# Altium schematic sheet PG01_ Cover Sheet.SchDoc
size 420 x 297 mm
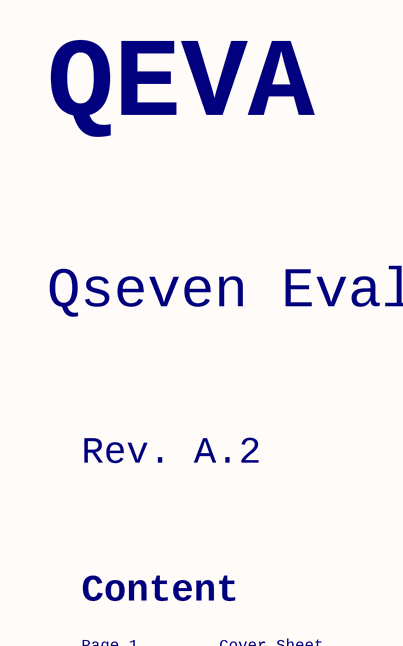
[diagram p0: PG01_ Cover Sheet.SchDoc, top left]
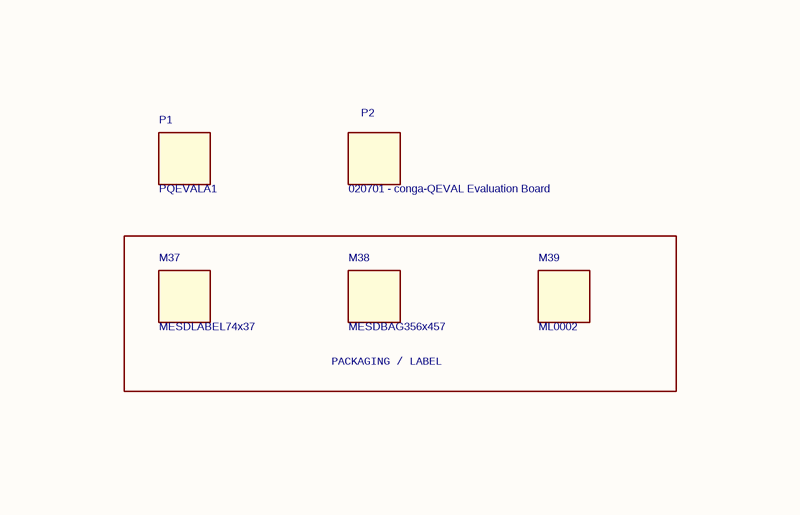
[diagram p1: PG01_ Cover Sheet.SchDoc, top right]
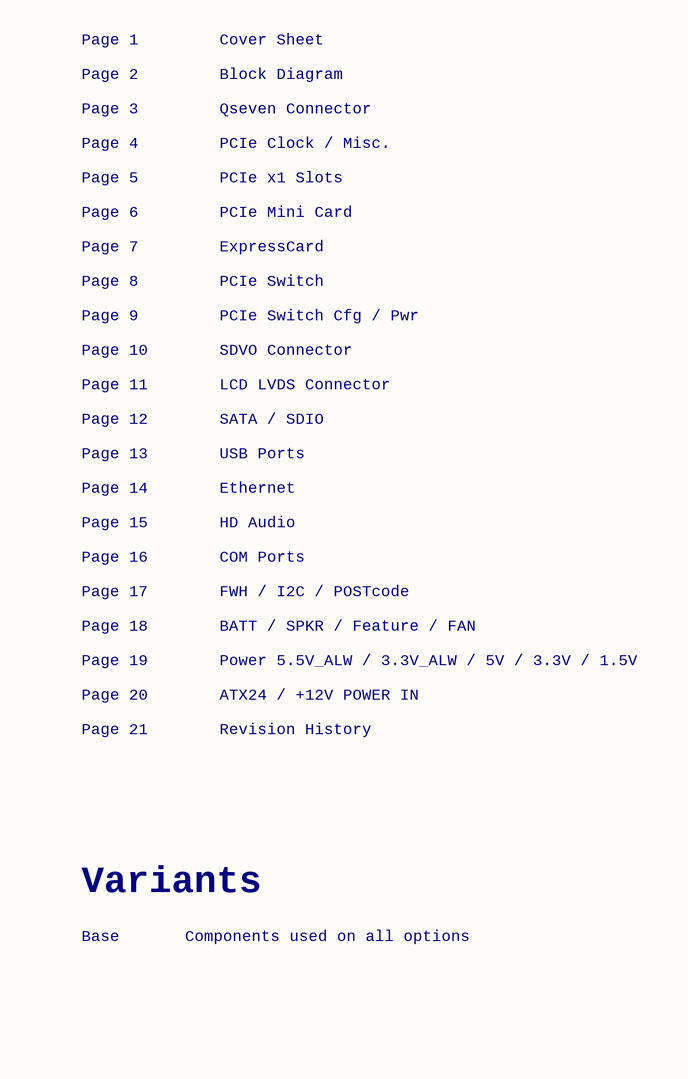
[diagram p2: PG01_ Cover Sheet.SchDoc, bottom left]
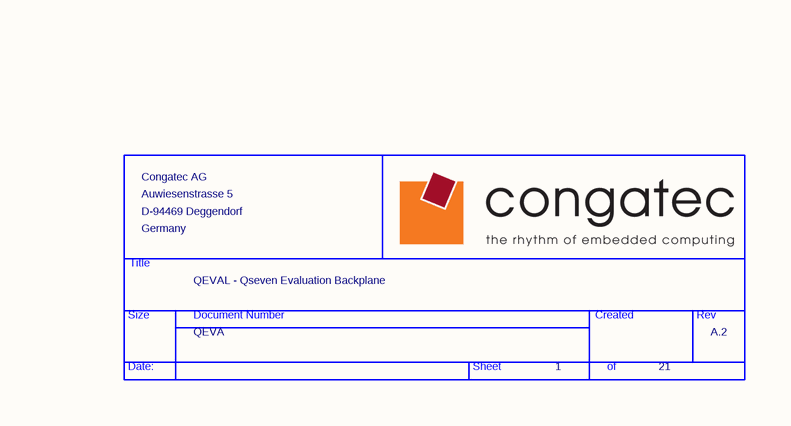
[diagram p3: PG01_ Cover Sheet.SchDoc, bottom right]

## Parts
*  Page Count: 21  Page Number: 1  Title: QEVAL - Qseven Evaluation Backplane  RevCode: A.2  Doc: QEVA  OrgName: Congatec AG  OrgAddr1: Auwiesenstrasse 5  OrgAddr2: D-94469 Deggendorf  OrgAddr3: Germany  (hidden comment: TitleBlock_CONGA)  (graphical)
M37  MESDLABEL74x37
M38  MESDBAG356x457
M39  ML0002
P1  PQEVALA1
P2  020701 - conga-QEVAL Evaluation Board

## Blocks framed on the sheet
PACKAGING / LABEL: M37-M39

## Notes on the sheet
- QEVA
- Qseven Evaluation Backplane
- Rev. A.2
- Content
- Page 1
- Cover Sheet
- Page 2
- Page 3
- Page 4
- Block Diagram
- Qseven Connector
- PCIe Clock / Misc.
- Page 5
- Page 6
- PCIe Mini Card
- PCIe x1 Slots
- Page 7
- Page 8
- Page 9
- ExpressCard
- PCIe Switch Cfg / Pwr
- PCIe Switch
- Page 10
- Page 11
- SDVO Connector
- LCD LVDS Connector
- Page 12
- Page 13
- Page 14
- SATA / SDIO
- Ethernet
- USB Ports
- Page 15
- Page 16
- COM Ports
- HD Audio
- Page 17
- Page 18
- Page 19
- FWH / I2C / POSTcode
- BATT / SPKR / Feature / FAN
- Power 5.5V_ALW / 3.3V_ALW / 5V / 3.3V / 1.5V
- Page 20
- Page 21
- Revision History
- ATX24 / +12V POWER IN
- Variants
- Base
- Components used on all options
- (in symbol TitleBlock_CONGA) Title; Size; Document Number; Created; Rev; Date:; Sheet; of

## Library data of the parts
M37 = Box PCB: Part_Number: 72000001; ManufacturerName1: Labelident; ManufacturerPart1: W120-74; BOM_Level: 1; ManufacturerDatasheet1: http://conds01/svn/Datasheet_DB/CIS/Miscellaneous/Labelident/LABELIDENT_KatalogSeite30-31.pdf; Revision: A
M38 = Box PCB: Part_Number: 71000001; ManufacturerName1: Ubitec; ManufacturerPart1: UA-3310.HS.1418/.1; BOM_Level: 1; ManufacturerDatasheet1: http://conds01/svn/Datasheet_DB/CIS/Miscellaneous/Ubitec/Highshield%20Verpackungsbeutel.pdf; Revision: A
M39 = Box PCB: Part_Number: 72000011; ManufacturerName1: Labelident; ManufacturerPart1: ERT-A032x009; BOM_Level: 1; ManufacturerDatasheet1: http://conds01/svn/Datasheet_DB/CIS/Miscellaneous/Labelident/LABELIDENT_KatalogSeite4.pdf; Revision: A
P1 = Box PCB: Part_Number: 45000136; BOM_Level: 1; Revision: A.1
P2 = Box PCB: Part_Number: 007001A; BOM_Level: 0; Revision: A.2
* = TitleBlock_CONGA: Page Create Date: March  8, 1995